# EAGLE design LEDDisp8 (EAGLE 6.2)
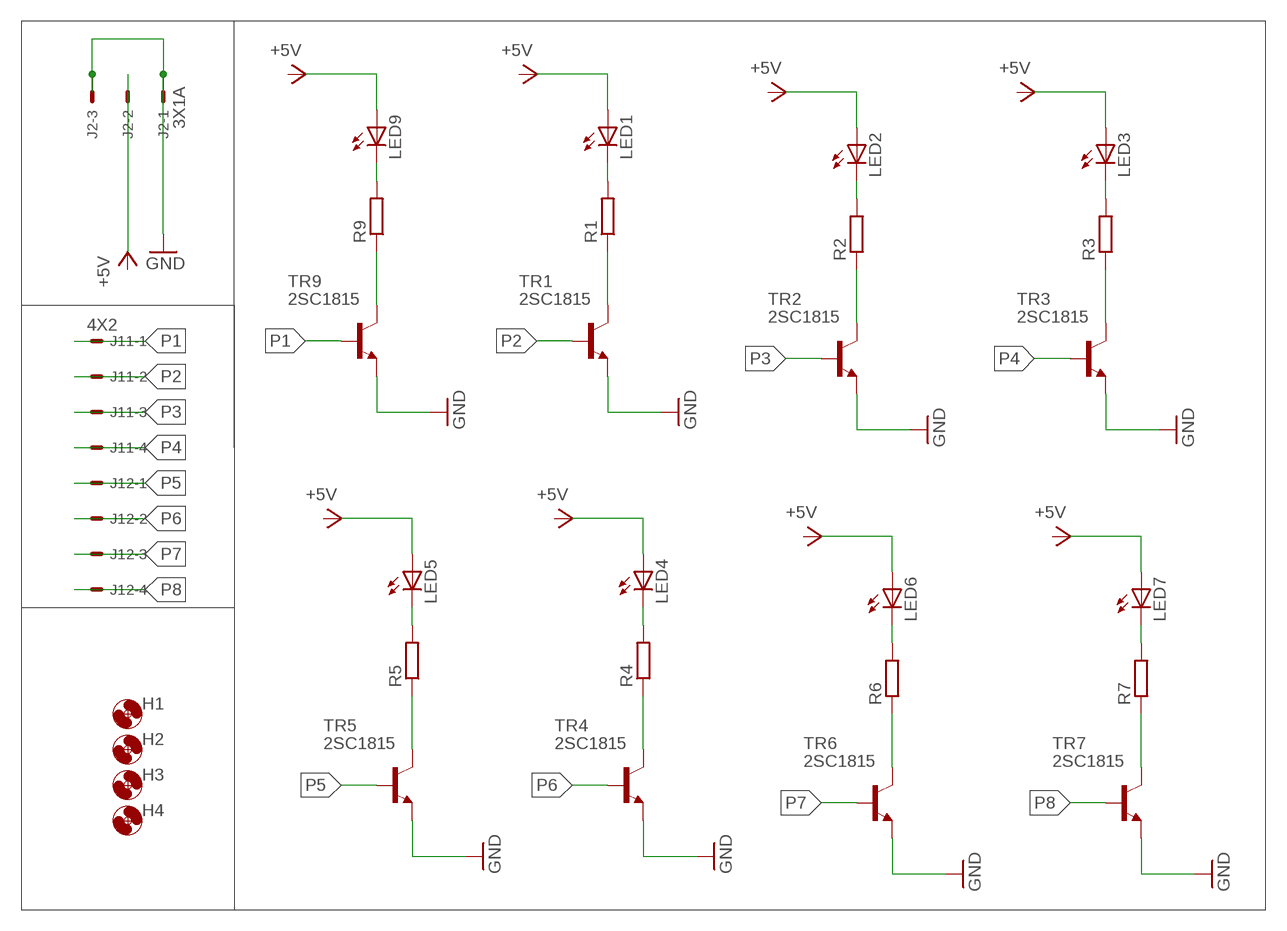
[diagram p0: schematic, sheet 1]

## Parts
H1  HOLE3.3M3BOLT  [HOLE3.3]
H2  HOLE3.3M3BOLT  [HOLE3.3]
H3  HOLE3.3M3BOLT  [HOLE3.3]
H4  HOLE3.3M3BOLT  [HOLE3.3]
J1  4X2  [37208-62A3-004]
J2  3X1A  [37203-62A3-003]
LED1  LED3MM  [LED3MM]
LED2  LED3MM  [LED3MM]
LED3  LED3MM  [LED3MM]
LED4  LED3MM  [LED3MM]
LED5  LED3MM  [LED3MM]
LED6  LED3MM  [LED3MM]
LED7  LED3MM  [LED3MM]
LED9  LED3MM  [LED3MM]
R1  R-EU_R3216W  [R3216W]
R2  R-EU_R3216W  [R3216W]
R3  R-EU_R3216W  [R3216W]
R4  R-EU_R3216W  [R3216W]
R5  R-EU_R3216W  [R3216W]
R6  R-EU_R3216W  [R3216W]
R7  R-EU_R3216W  [R3216W]
R9  R-EU_R3216W  [R3216W]
TR1  2SC1815  [TO92-]
TR2  2SC1815  [TO92-]
TR3  2SC1815  [TO92-]
TR4  2SC1815  [TO92-]
TR5  2SC1815  [TO92-]
TR6  2SC1815  [TO92-]
TR7  2SC1815  [TO92-]
TR9  2SC1815  [TO92-]

## Nets
GND: J2.1-1 J2.1-3 TR1.E TR2.E TR3.E TR4.E TR5.E TR6.E TR7.E TR9.E
N$1: R1.1 TR1.C
N$2: J2.1-2
N$3: LED1.A
N$4: R9.1 TR9.C
N$5: LED9.K(C) R9.2
N$6: LED9.A
N$7: R2.1 TR2.C
N$8: LED2.A
N$9: R3.1 TR3.C
N$10: LED3.A
N$11: R4.1 TR4.C
N$12: LED4.A
N$13: R5.1 TR5.C
N$14: LED5.A
N$15: R6.1 TR6.C
N$16: LED6.A
N$17: R7.1 TR7.C
N$18: LED7.A
N$19: LED1.K(C) R1.2
N$21: LED2.K(C) R2.2
N$22: LED6.K(C) R6.2
N$23: LED3.K(C) R3.2
N$24: LED4.K(C) R4.2
N$25: LED7.K(C) R7.2
N$26: LED5.K(C) R5.2
P1: J1.1-1 TR9.B
P2: J1.1-2 TR1.B
P3: J1.1-3 TR2.B
P4: J1.1-4 TR3.B
P5: J1.2-1 TR5.B
P6: J1.2-2 TR4.B
P7: J1.2-3 TR6.B
P8: J1.2-4 TR7.B

## Library data of the parts
H1-H4 = Hole:HOLE3.3
J1 = 3M_372xx:4X2
J2 = 3M_372xx:3X1
LED1-LED7 LED9 = FP-21T for MITS:LED: LED OSRAM: - CHIPLED LG R971, LG N971, LY N971, LG Q971, LY Q971, LO R971, LY R971 LH N974, LH R974 LS Q976, LO Q976, LY Q976 LO Q996 - Hyper CHIPLED LW Q18S LB Q993, LB Q99A, LB R99A - SideLED LS A670, LO A670, LY A670, LG A670, LP A670 LB A673, LV A673, LT A673, LW A673 LH A674 LY A675 LS A676, LA A676, LO A676, LY A676, LW A676 LS A679, LY A679, LG A679 - Hyper Micro SIDELED® LS Y876, LA Y876, LO Y876, LY Y876 LT Y87S - SmartLED LW L88C, LW L88S LB L89C, LB L89S, LG L890 LS L89K, LO L89K, LY L89K LS L896, LA L896, LO L896, LY L896 - TOPLED LS T670, LO T670, LY T670, LG T670, LP T670 LSG T670, LSP T670, LSY T670, LOP T670, LYG T670 LG T671, LOG T671, LSG T671 LB T673, LV T673, LT T673, LW T673 LH T674 LS T676, LA T676, LO T676, LY T676, LB T676, LH T676, LSB T676, LW T676 LB T67C, LV T67C, LT T67C, LS T67K, LO T67K, LY T67K, LW E67C LS E67B, LA E67B, LO E67B, LY E67B, LB E67C, LV E67C, LT E67C LW T67C LS T679, LY T679, LG T679 LS T770, LO T770, LY T770, LG T770, LP T770 LB T773, LV T773, LT T773, LW T773 LH T774 LS E675, LA E675, LY E675, LS T675 LS T776, LA T776, LO T776, LY T776, LB T776 LHGB T686 LT T68C, LB T68C - Hyper Mini TOPLED® LB M676 - Mini TOPLED Santana® LG M470 LS M47K, LO M47K, LY M47K Source: http://www.osram.convergy.de - LUMILED® LXK2-PW12-R00, LXK2-PW12-S00, LXK2-PW14-U00, LXK2-PW14-V00 LXK2-PM12-R00, LXK2-PM12-S00, LXK2-PM14-U00 LXK2-PE12-Q00, LXK2-PE12-R00, LXK2-PE12-S00, LXK2-PE14-T00, LXK2-PE14-U00 LXK2-PB12-K00, LXK2-PB12-L00, LXK2-PB12-M00, LXK2-PB14-N00, LXK2-PB14-P00, LXK2-PB14-Q00 LXK2-PR12-L00, LXK2-PR12-M00, LXK2-PR14-Q00, LXK2-PR14-R00 LXK2-PD12-Q00, LXK2-PD12-R00, LXK2-PD12-S00 LXK2-PH12-R00, LXK2-PH12-S00 LXK2-PL12-P00, LXK2-PL12-Q00, LXK2-PL12-R00 Source: www.luxeon.com
R1-R7 R9 = rcl:R-EU_: RESISTOR, European symbol
TR1-TR7 TR9 = FP-21T for MITS:2SC1815

## Board
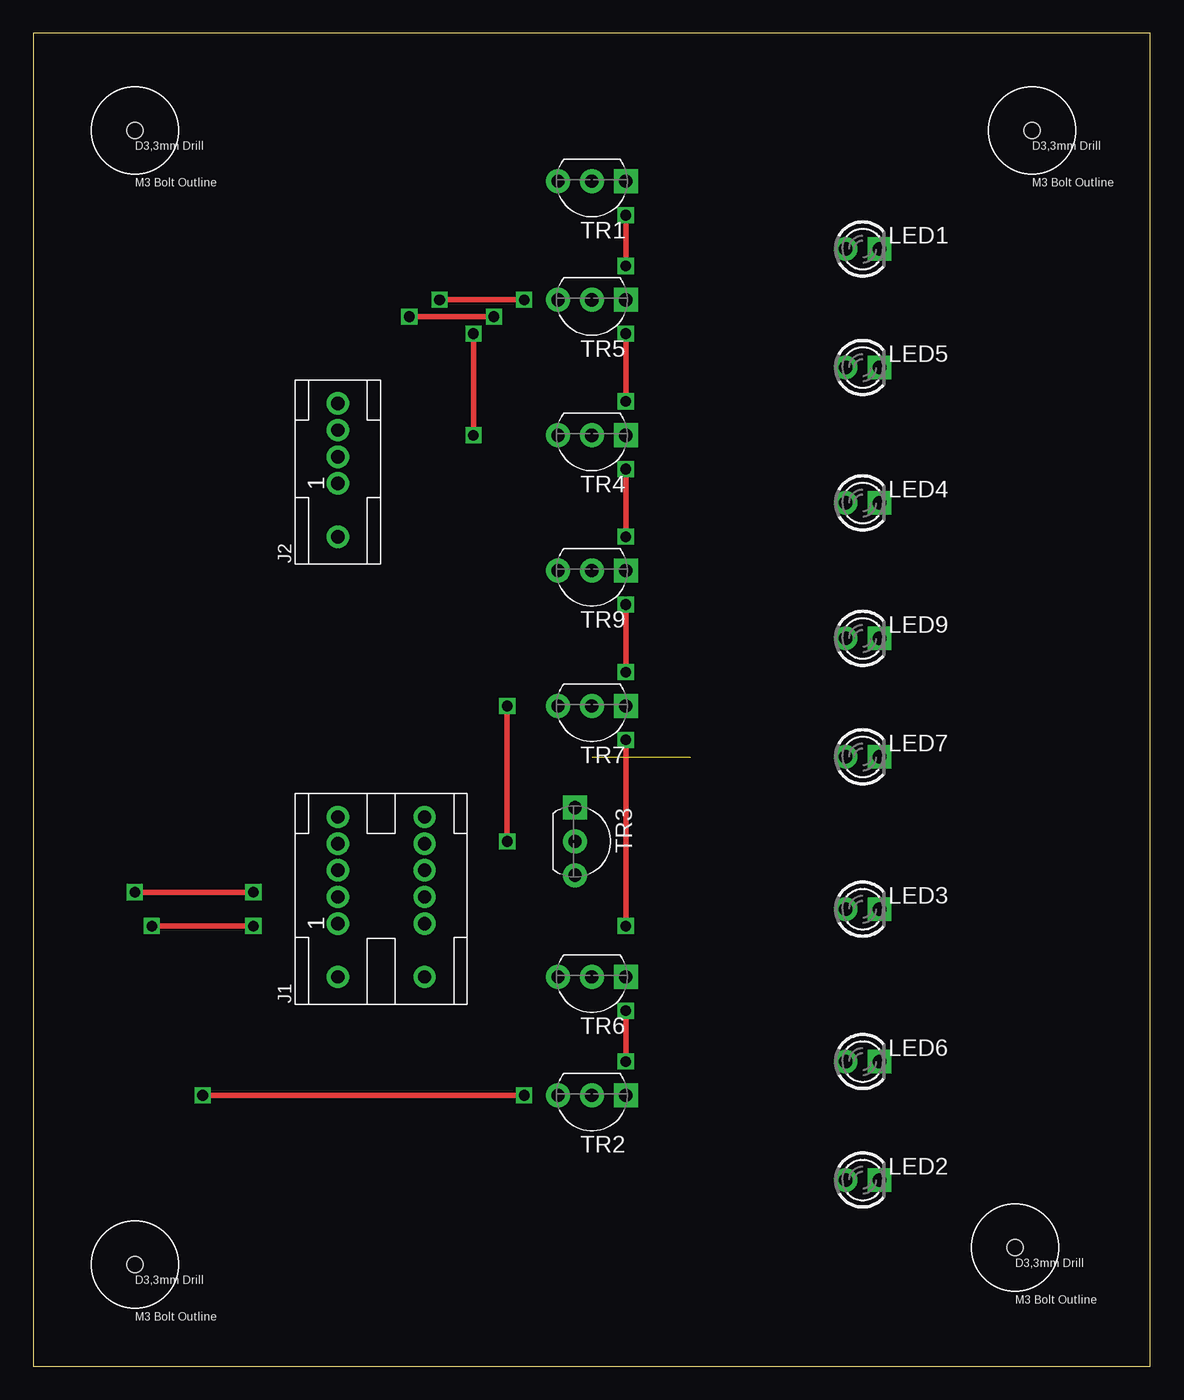
[diagram p1: board, top side]
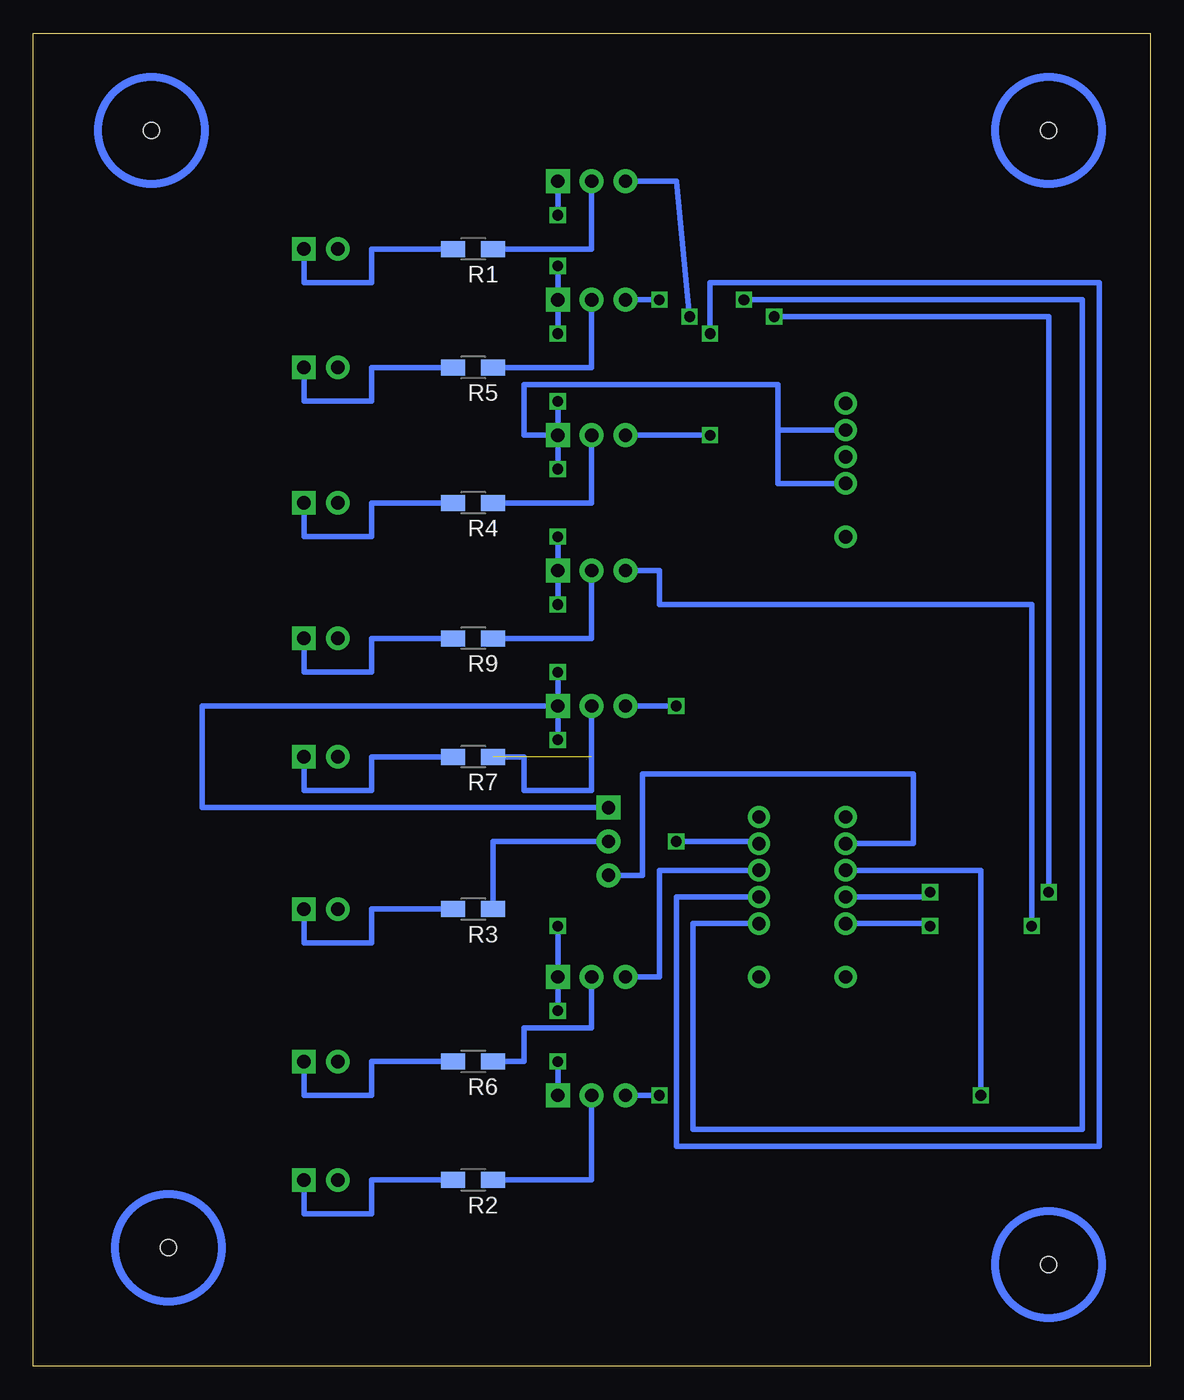
[diagram p2: board, bottom side, seen from below]

Size 83.8 x 100 mm. Coordinates in mm from the lower left corner, seen from the top.
Outline: 0,0 83.8,0 83.8,100 0,100 0,0
Copper layers (1*16): Top 0.035mm / dielectric 1.5mm / Bottom 0.035mm
Design rules: minimum track width 10mil, minimum drill 24mil, track to track 8mil, track to pad 8mil, pad to pad 8mil, via to via 8mil, smd to smd 8mil, copper to edge 40mil, drill to drill 8mil, minimum pad ring 10mil, minimum via ring 8mil, stop-mask expansion 4mil, vias tented up to drill 0mil, thermal gap 10mil

### Footprints (pad centres in the part's own frame; a part is rotated, then mirrored left to right if it is on the bottom)
HOLE3.3 = hole 1.2: 0,0
37208-62A3-004 = drill 1 pad 1.676: 1-1 0,4; 1-2 0,6; 1-3 0,8; 1-4 0,10; 2-1 6.5,4; 2-2 6.5,6; 2-3 6.5,8; 2-4 6.5,10; P$1 0,0; P$2 0,12; P$3 6.5,0; P$4 6.5,12
37203-62A3-003 = drill 1 pad 1.676: 1-1 0,4; 1-2 0,6; 1-3 0,8; P$1 0,0; P$2 0,10
LED3MM = drill 1 pad 1.778: A -1.27,0 | drill 1 pad 1.778 square: K 1.27,0
R3216W = smd 1.8 x 1.2: 1 -1.499,0; 2 1.499,0
TO92- = drill 1 pad 1.8: B 2.54,0; C 0,0 | drill 1 pad 1.8 square: E -2.54,0

### Placement (x,y rotation side)
H1  7.62,92.71 0 top
H2  7.62,7.62 0 top
H3  74.93,92.71 0 top
H4  73.66,8.89 0 top
J1  22.86,29.21 0 top
J2  22.86,62.23 0 top
LED1  62.23,83.82 0 top
LED2  62.23,13.97 0 top
LED3  62.23,34.29 0 top
LED4  62.23,64.77 0 top
LED5  62.23,74.93 0 top
LED6  62.23,22.86 0 top
LED7  62.23,45.72 0 top
LED9  62.23,54.61 0 top
R1  50.8,83.82 180 bottom
R2  50.8,13.97 180 bottom
R3  50.8,34.29 180 bottom
R4  50.8,64.77 180 bottom
R5  50.8,74.93 180 bottom
R6  50.8,22.86 180 bottom
R7  50.8,45.72 180 bottom
R9  50.8,54.61 180 bottom
TR1  41.91,88.9 180 top
TR2  41.91,20.32 180 top
TR3  40.64,39.37 270 top
TR4  41.91,69.85 180 top
TR5  41.91,80.01 180 top
TR6  41.91,29.21 180 top
TR7  41.91,49.53 180 top
TR9  41.91,59.69 180 top

### Tracks (layer width: path | path; a pad name or v marks a point on that pad's centre or on a via)
GND  (via drill 0.8)
  Top 0.406: v44.45,46.99 v44.45,33.02 | v44.45,57.15 v44.45,52.07 | v44.45,86.36 v44.45,82.55 | v44.45,77.47 v44.45,72.39 | v44.45,67.31 v44.45,62.23 | v44.45,26.67 v44.45,22.86
  Bottom 0.406: TR7.E v44.45,46.99 | v44.45,57.15 TR9.E v44.45,62.23 | v44.45,52.07 TR7.E | TR1.E v44.45,86.36 | v44.45,82.55 TR5.E v44.45,77.47 | v44.45,72.39 TR4.E | TR4.E v44.45,67.31 | v44.45,33.02 TR6.E v44.45,26.67 | v44.45,22.86 TR2.E | TR3.E 71.12,41.91 71.12,49.53 TR7.E | TR4.E 46.99,69.85 46.99,73.66 35.56,73.66 27.94,73.66 27.94,71.12 27.94,70.23 | 27.94,70.23 J2.1-3 | J2.1-1 27.94,66.23 27.94,70.23
N$1
  Bottom 0.406: TR1.C 41.91,83.82 R1.1
N$4
  Bottom 0.406: TR9.C 41.91,54.61 R9.1
N$5
  Bottom 0.406: LED9.K 63.5,52.07 59.69,52.07 58.42,52.07 58.42,54.61 R9.2
N$7
  Bottom 0.406: TR2.C 41.91,13.97 R2.1
N$9
  Bottom 0.406: R3.1 49.3,39.37 TR3.C
N$11
  Bottom 0.406: TR4.C 41.91,64.77 R4.1
N$13
  Bottom 0.406: TR5.C 41.91,74.93 R5.1
N$15
  Bottom 0.406: TR6.C 41.91,25.4 46.99,25.4 46.99,22.86 R6.1
N$17  (1 unrouted)
  Bottom 0.406: TR7.C 41.91,43.18 46.99,43.18 46.99,45.72 R7.1
N$19
  Bottom 0.406: LED1.K 63.5,81.28 59.69,81.28 58.42,81.28 58.42,83.82 R1.2
N$21
  Bottom 0.406: LED2.K 63.5,11.43 59.69,11.43 58.42,11.43 58.42,13.97 R2.2
N$22
  Bottom 0.406: LED6.K 63.5,20.32 59.69,20.32 58.42,20.32 58.42,22.86 R6.2
N$23
  Bottom 0.406: LED3.K 63.5,31.75 59.69,31.75 58.42,31.75 58.42,34.29 R3.2
N$24
  Bottom 0.406: LED4.K 63.5,62.23 59.69,62.23 58.42,62.23 58.42,64.77 R4.2
N$25
  Bottom 0.406: LED7.K 63.5,43.18 58.42,43.18 58.42,45.72 R7.2
N$26
  Bottom 0.406: LED5.K 63.5,72.39 59.69,72.39 58.42,72.39 58.42,74.93 R5.2
P1  (via drill 0.8)
  Top 0.406: v16.51,33.02 v8.89,33.02
  Bottom 0.406: J1.1-1 16.51,33.21 v16.51,33.02 | v8.89,33.02 8.89,57.15 36.83,57.15 36.83,59.69 TR9.B
P2  (via drill 0.8)
  Top 0.406: v16.51,35.56 v7.62,35.56 | v34.56,78.74 v28.21,78.74
  Bottom 0.406: J1.1-2 16.51,35.21 v16.51,35.56 | v7.62,35.56 7.62,78.74 v28.21,78.74 | v34.56,78.74 35.56,88.9 TR1.B
P3  (via drill 0.8)
  Top 0.406: v36.83,20.32 v12.7,20.32
  Bottom 0.406: TR2.B v36.83,20.32 | v12.7,20.32 12.7,36.83 12.7,37.21 J1.1-3
P4
  Bottom 0.406: J1.1-4 17.78,39.21 17.78,44.45 36.83,44.45 38.1,44.45 38.1,36.83 TR3.B
P5  (via drill 0.8)
  Top 0.406: v36.83,80.01 v30.48,80.01
  Bottom 0.406: J1.2-1 34.29,33.21 34.29,17.78 5.08,17.78 5.08,80.01 v30.48,80.01 | TR5.B v36.83,80.01
P6  (via drill 0.8)
  Top 0.406: v33.02,77.47 v33.02,69.85
  Bottom 0.406: J1.2-2 35.56,35.21 35.56,16.51 3.81,16.51 3.81,81.28 33.02,81.28 v33.02,77.47 | 34.29,69.85 v33.02,69.85 34.29,69.85 | 34.29,69.85 TR4.B
P7
  Bottom 0.406: J1.2-3 36.83,37.21 36.83,29.21 TR6.B
P8  (via drill 0.8)
  Top 0.406: v35.56,39.37 v35.56,49.53
  Bottom 0.406: v35.56,49.53 TR7.B | J1.2-4 29.36,39.37 v35.56,39.37